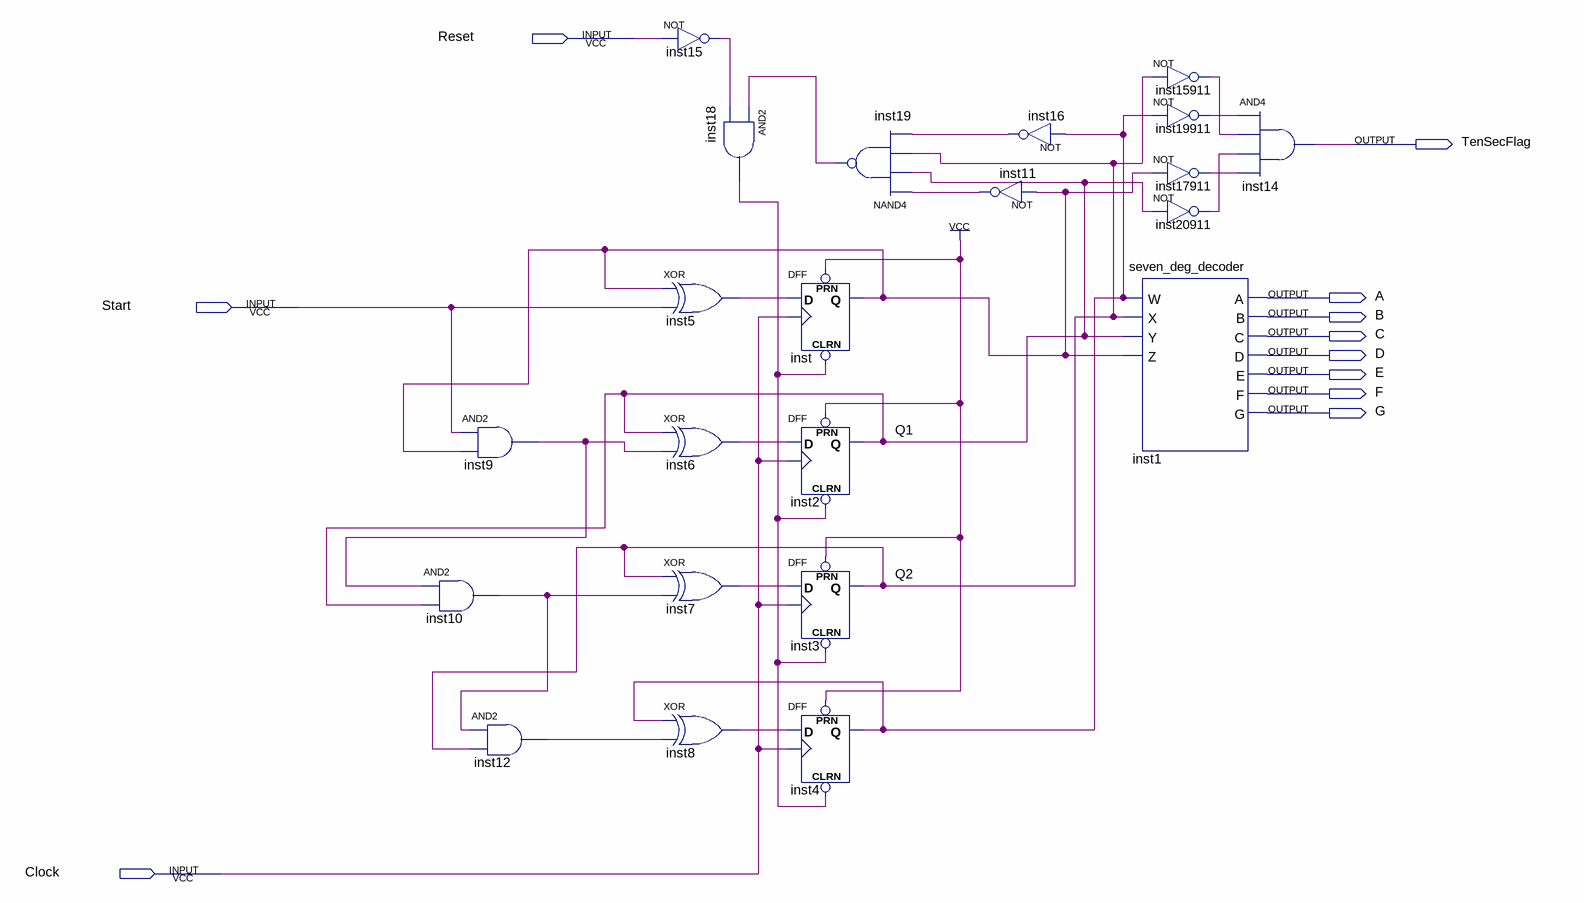
[diagram p0: schematic sheet]
// Quartus schematic FinProjT2.bdf as structural Verilog: 22 symbols, 11 pins
module FinProjT2 (
  input  Reset,
  input  Start,
  input  Clock,
  output TenSecFlag,
  output A,
  output B,
  output C,
  output D,
  output E,
  output F,
  output G
);

  wire inst4_q, inst5_out, inst6_out, inst7_out, inst8_out, inst9_out, inst10_out, inst11_out, inst12_out,
       inst15_out, inst16_out, inst18_out, inst19_out, inst15911_out, inst17911_out, inst19911_out,
       inst20911_out, inst_q, Q1, Q2;

  and inst10 (inst10_out, inst9_out, Q1);
  and inst9 (inst9_out, Start, inst_q);
  and inst12 (inst12_out, inst10_out, Q2);
  not inst15 (inst15_out, Reset);
  and inst18 (inst18_out, inst19_out, inst15_out);
  xor inst5 (inst5_out, inst_q, Start);
  xor inst6 (inst6_out, Q1, inst9_out);
  xor inst7 (inst7_out, Q2, inst10_out);
  xor inst8 (inst8_out, inst4_q, inst12_out);
  DFF inst (.CLRN(inst18_out), .CLK(Clock), .D(inst5_out), .PRN(1'b1), .Q(inst_q));
  DFF inst2 (.CLRN(inst18_out), .CLK(Clock), .D(inst6_out), .PRN(1'b1), .Q(Q1));
  DFF inst3 (.CLRN(inst18_out), .CLK(Clock), .D(inst7_out), .PRN(1'b1), .Q(Q2));
  DFF inst4 (.CLRN(inst18_out), .CLK(Clock), .D(inst8_out), .PRN(1'b1), .Q(inst4_q));
  nand inst19 (inst19_out, inst11_out, Q1, Q2, inst16_out);
  not inst16 (inst16_out, inst4_q);
  not inst11 (inst11_out, inst_q);
  not inst15911 (inst15911_out, Q2);
  not inst19911 (inst19911_out, inst4_q);
  not inst17911 (inst17911_out, inst_q);
  not inst20911 (inst20911_out, Q1);
  seven_deg_decoder inst1 (.W(inst4_q), .X(Q2), .Y(Q1), .Z(inst_q), .A(A), .B(B), .C(C), .D(D), .E(E), .F(F), .G(G));
  and inst14 (TenSecFlag, inst19911_out, inst15911_out, inst20911_out, inst17911_out);
endmodule
